# Altium schematic sheet TX.SchDoc
size A4
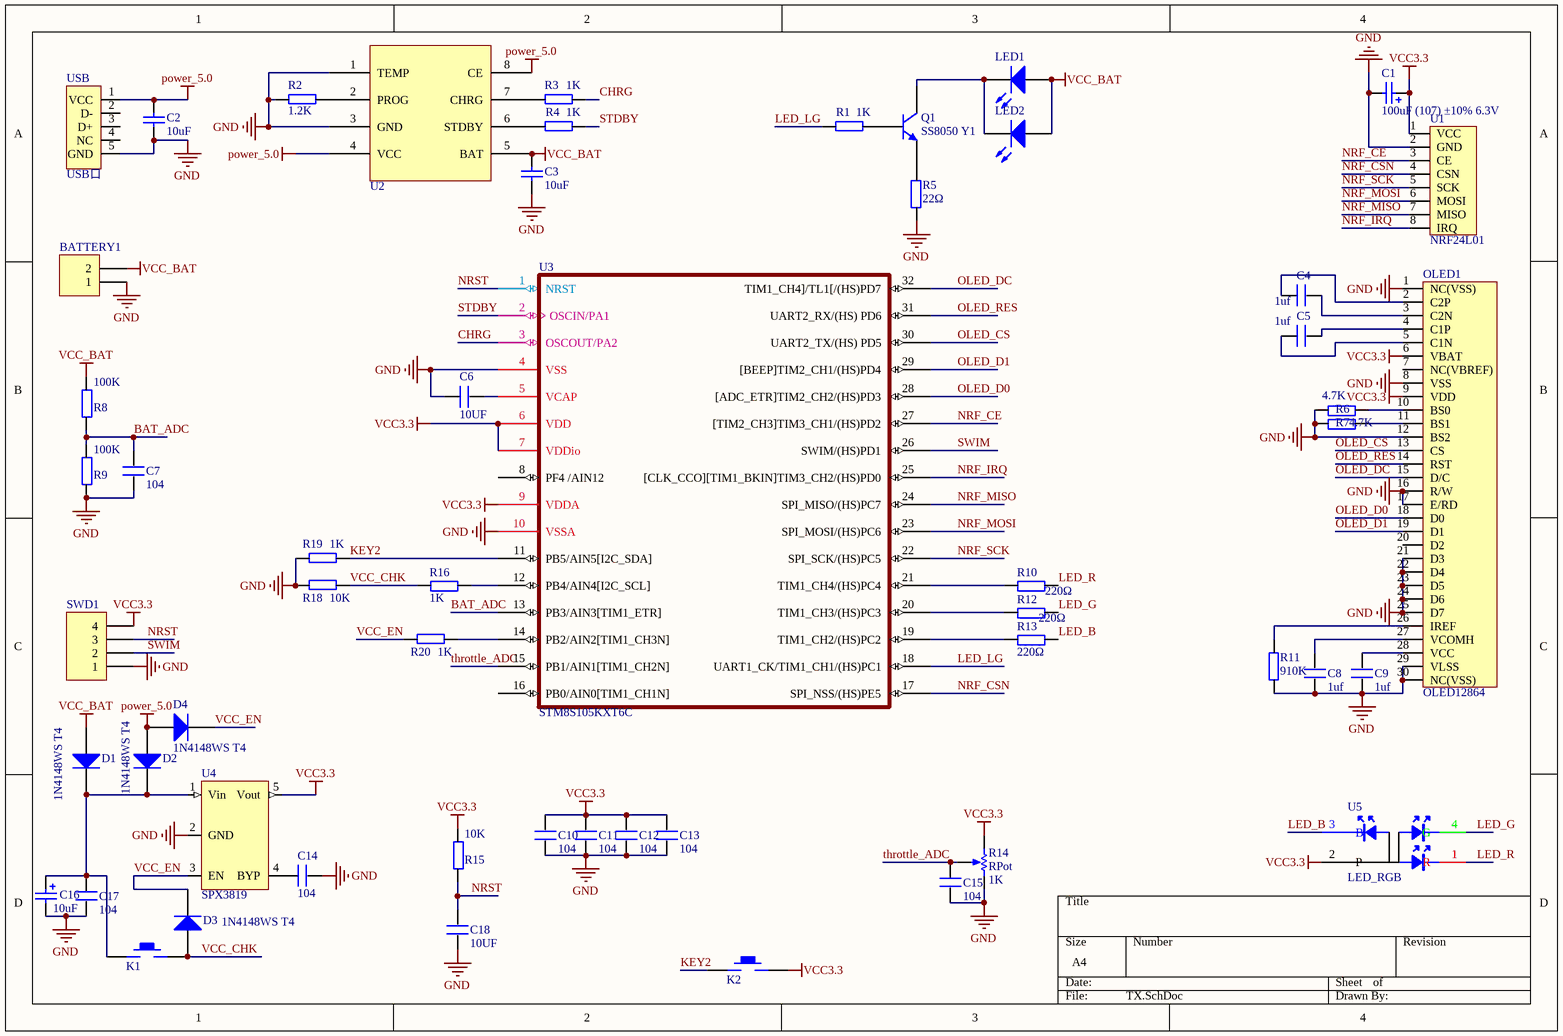
[diagram p0: TX.SchDoc]

## Parts
BATTERY1  battery  [HDR1X2]  (value not drawn)
C1  100uF (107) ±10% 6.3V  [CASE-B_3528]
C2  10uF  [1206_C]
C3  10uF  [1206_C]
C4  1uf  [0603P]
C5  1uf  [0603P]
C6  10UF  [0805]
C7  104  [0603P]
C8  1uf  [0603P]
C9  1uf  [0603P]
C10  104  [0603P]
C11  104  [0603P]
C12  104  [0603P]
C13  104  [0603P]
C14  104  [0603P]
C15  104  [0603P]
C16  10uF  [CASE-A_3216]
C17  104  [0603P]
C18  10UF  [0603P]
D1  1N4148WS T4  [SOD-323]
D2  1N4148WS T4  [SOD-323]
D3  1N4148WS T4  [SOD-323]
D4  1N4148WS T4  [SOD-323]
K1  KEY  [侧贴按键]  (value not drawn)
K2  KEY  [侧贴按键]  (value not drawn)
LED1  LED  [DIODE_3*5.3]  (value not drawn)
LED2  LED  [DIODE_3*5.3]  (value not drawn)
OLED1  OLED12864  [OLED_0.96]
Q1  SS8050 Y1  [SOT-23(SOT-23-3)]
R1  1K  [0603P]
R2  1.2K  [0603P]
R3  1K  [0603P]
R4  1K  [0603P]
R5  22Ω  [0603P]
R6  4.7K  [0603P]
R7  4.7K  [0603P]
R8  100K  [0603P]
R9  100K  [0603P]
R10  220Ω  [0603P]
R11  910K  [0603P]
R12  220Ω  [0603P]
R13  220Ω  [0603P]
R14  RPot  value 1K  [R_variable]
R15  10K  [0603P]
R16  1K  [0603P]
R18  10K  [0603P]
R19  1K  [0603P]
R20  1K  [0603P]
SWD1  SWD  [HDR1X4]  (value not drawn)
U1  NRF24L01  [miniNRF24L01]
U2  TP4056-SOT8  [SOP-8]  (value not drawn)
U3  STM8S105KXT6C  [TQFP32]
U4  SPX3819  [SOT25-5]
U5  LED_RGB  [LED_RGB]
USB  USB口  [MICRO USB]

## Nets
GND: BATTERY1.1 C1.2 C2.1 C3.1 C6.2 C7.1 C8.1 C9.1 C10.1 C11.1 C12.1 C13.1 C14.1 C15.1 C16.2 C17.1 C18.1 OLED1.1(NC(VSS)) OLED1.8(VSS) OLED1.12(BS2) OLED1.16(R/W) OLED1.17(E/RD) OLED1.21(D3) OLED1.22(D4) OLED1.23(D5) OLED1.24(D6) OLED1.25(D7) OLED1.29(VLSS) OLED1.30(NC(VSS)) R2.2 R5.2 R6.1 R7.1 R9.1 R11.2 R14.2(BOT) R18.2 R19.2 SWD1.1 U1.2(GND) U2.1(TEMP) U2.3(GND) U3.4(VSS) U3.10(VSSA) U4.2(GND) USB.5(GND)
power_5.0: C2.2 D2.1(A) D4.1(A) U2.4(VCC) U2.8(CE) USB.1(VCC)
VCC3.3: C1.1 C10.2 C11.2 C12.2 C13.2 K2.2 OLED1.6(VBAT) OLED1.9(VDD) R14.1(TOP) R15.2 SWD1.4 U1.1(VCC) U3.6(VDD) U3.7(VDDio) U3.9(VDDA) U4.5(Vout) U5.2(P)
VCC_BAT: BATTERY1.2 C3.2 D1.1(A) LED1.1(A) LED2.1(A) R8.2 U2.5(BAT)
BAT_ADC: C7.2 R8.1 R9.2 U3.13(PB3/AIN3[TIM1_ETR])
CHRG: R3.1 U3.3(OSCOUT/PA2)
KEY2: K2.1 R19.1 U3.11(PB5/AIN5[I2C_SDA])
LED_B: R13.2 U5.3(B)
LED_G: R12.2 U5.4(G)
LED_LG: R1.2 U3.18(UART1_CK/TIM1_CH1/(HS)PC1)
LED_R: R10.2 U5.1(R)
NRF_CE: U1.3(CE) U3.27([TIM2_CH3]TIM3_CH1/(HS)PD2)
NRF_CSN: U1.4(CSN) U3.17(SPI_NSS/(HS)PE5)
NRF_IRQ: U1.8(IRQ) U3.25([CLK_CCO][TIM1_BKIN]TIM3_CH2/(HS)PD0)
NRF_MISO: U1.7(MISO) U3.24(SPI_MISO/(HS)PC7)
NRF_MOSI: U1.6(MOSI) U3.23(SPI_MOSI/(HS)PC6)
NRF_SCK: U1.5(SCK) U3.22(SPI_SCK/(HS)PC5)
NRST: C18.2 R15.1 SWD1.3 U3.1(NRST)
OLED_CS: OLED1.13(CS) U3.30(UART2_TX/(HS)_PD5)
OLED_D0: OLED1.18(D0) U3.28([ADC_ETR]TIM2_CH2/(HS)PD3)
OLED_D1: OLED1.19(D1) U3.29([BEEP]TIM2_CH1/(HS)PD4)
OLED_DC: OLED1.15(D/C) U3.32(TIM1_CH4]/TL1[/(HS)PD7)
OLED_RES: OLED1.14(RST) U3.31(UART2_RX/(HS)_PD6)
STDBY: R4.1 U3.2(OSCIN/PA1)
SWIM: SWD1.2 U3.26(SWIM/(HS)PD1)
throttle_ADC: C15.2 R14.3(TAP) U3.15(PB1/AIN1[TIM1_CH2N])
VCC_CHK: D3.1(A) K1.2 R16.1 R18.1
VCC_EN: D3.2(K) D4.2(K) R20.2 U4.3(EN)
NetC4_1: C4.1 OLED1.2(C2P)
NetC4_2: C4.2 OLED1.3(C2N)
NetC5_1: C5.1 OLED1.5(C1N)
NetC5_2: C5.2 OLED1.4(C1P)
NetC6_1: C6.1 U3.5(VCAP)
NetC8_2: C8.2 OLED1.27(VCOMH)
NetC9_2: C9.2 OLED1.28(VCC)
NetC14_2: C14.2 U4.4(BYP)
NetC16_1: C16.1 C17.2 D1.2(K) D2.2(K) K1.1 U4.1(Vin)
NetLED1_2: LED1.2(K) LED2.2(K) Q1.3(C)
NetOLED1_10: OLED1.10(BS0) R6.2
NetOLED1_11: OLED1.11(BS1) R7.2
NetOLED1_26: OLED1.26(IREF) R11.1
NetQ1_1: Q1.1(B) R1.1
NetQ1_2: Q1.2(E) R5.1
NetR2_1: R2.1 U2.2(PROG)
NetR3_2: R3.2 U2.7(CHRG)
NetR4_2: R4.2 U2.6(STDBY)
NetR10_1: R10.1 U3.21(TIM1_CH4/(HS)PC4)
NetR12_1: R12.1 U3.20(TIM1_CH3/(HS)PC3)
NetR13_1: R13.1 U3.19(TIM1_CH2/(HS)PC2)
NetR16_2: R16.2 U3.12(PB4/AIN4[I2C_SCL])
NetR20_1: R20.1 U3.14(PB2/AIN2[TIM1_CH3N])

Not connected (* = marked no-connect by the designer): OLED1 7(NC(VBREF)) 20(D2); U3 8(PF4_/AIN12) 16(PB0/AIN0[TIM1_CH1N]); USB 2(D-) 3(D+) 4(NC)

## Library data of the parts
BATTERY1 = Header 2: Header, 2-Pin; LatestRevisionDate: 17-Jul-2002; LatestRevisionNote: Re-released for DXP Platform.; Publisher: Altium Limited
C1 = 3528 100uF (107) 10% 6.3V: 钽电容; ComponentLink1Description: 供应商链接; ComponentLink1URL: http://www.szlcsc.com/product/details_16815.html; Package: 3528; Supplier: LC; SuppliersPartNumber: C16133
C2 C3 = 1206 10uF (106) 10% 50V: 贴片电容; ComponentLink1Description: 供应商链接; ComponentLink1URL: http://www.szlcsc.com/product/details_14236.html; Package: 1206; Supplier: LC; SuppliersPartNumber: C13585
C4-C15 C17 C18 = C
C16 = 3216 10uF (106) 10% 16V: 钽电容; ComponentLink1Description: 供应商链接; ComponentLink1URL: http://www.szlcsc.com/product/details_7643.html; Package: 3216; Supplier: LC; SuppliersPartNumber: C7171
D1-D4 = SOD-323 1N4148WS T4: 二极管; ComponentLink1Description: 供应商链接; ComponentLink1URL: http://www.szlcsc.com/product/details_2485.html; Package: SOD-323; Supplier: LC; SuppliersPartNumber: C2128
K1 K2 = KEY_M
LED1 LED2 = LED2: Typical RED, GREEN, YELLOW, AMBER GaAs LED; Published: 8-Jun-2000; LatestRevisionDate: 17-Jul-2002; LatestRevisionNote: Re-released for DXP Platform.; PackageDocument: Feb-2002; PackageReference: 3.2X1.6X1.1; Publisher: Altium Limited
Q1 = SOT-23 SS8050 Y1: 三极管; ComponentLink1Description: 供应商链接; ComponentLink1URL: http://www.szlcsc.com/product/details_2507.html; Package: SOT-23; Supplier: LC; SuppliersPartNumber: C2150
R1-R13 R15 R16 R18-R20 = R
R14 = RPot: Potentiometer; pin to pad: 2>3 3>2; Sim Note: Enter the Resistance value and the set point into parameter fields.; Set Position: 0.5; Published: 8-Jun-2000; LatestRevisionDate: 17-Jul-2002; LatestRevisionNote: Re-released for DXP Platform.; PackageReference: VR5; Publisher: Altium Limited
SWD1 = Header 4: Header, 4-Pin; LatestRevisionDate: 17-Jul-2002; LatestRevisionNote: Re-released for DXP Platform.; Publisher: Altium Limited
U2 = TP4056
U3 = STM8S105K4T6C: ST 8-bit  Microcontroller
U5 = LED_RGB: 全彩LED